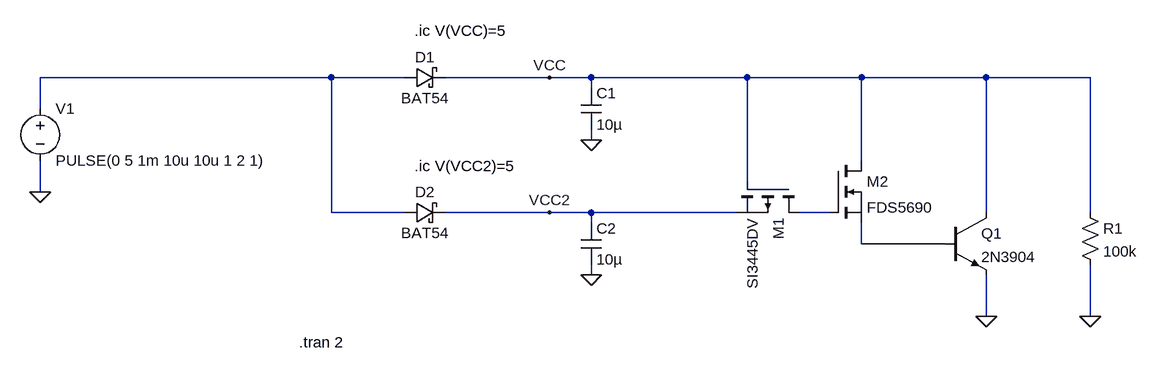
[diagram p0: schematic Draft1.asc]
Draft1.asc, the LTspice schematic file:
Version 4
SHEET 1 1440 680
WIRE 32 80 -416 80
WIRE 144 80 32 80
WIRE 368 80 208 80
WIRE 432 80 368 80
WIRE 672 80 432 80
WIRE 848 80 672 80
WIRE 1040 80 848 80
WIRE 1200 80 1040 80
WIRE 432 96 432 80
WIRE -416 128 -416 80
WIRE 432 176 432 160
WIRE 848 208 848 80
WIRE 672 240 672 80
WIRE -416 256 -416 208
WIRE 32 288 32 80
WIRE 144 288 32 288
WIRE 368 288 208 288
WIRE 432 288 368 288
WIRE 656 288 432 288
WIRE 800 288 752 288
WIRE 1040 288 1040 80
WIRE 1200 288 1200 80
WIRE 432 304 432 288
WIRE 848 336 848 304
WIRE 976 336 848 336
WIRE 432 384 432 368
WIRE 1040 448 1040 384
WIRE 1200 448 1200 368
FLAG -416 256 0
FLAG 432 176 0
FLAG 368 80 VCC
FLAG 1040 448 0
FLAG 432 384 0
FLAG 368 288 VCC2
FLAG 1200 448 0
SYMBOL voltage -416 112 R0
WINDOW 123 0 0 Left 0
WINDOW 39 0 0 Left 0
SYMATTR InstName V1
SYMATTR Value PULSE(0 5 1m 10u 10u 1 2 1)
SYMBOL schottky 144 96 R270
WINDOW 0 32 32 VTop 2
WINDOW 3 0 32 VBottom 2
SYMATTR InstName D1
SYMATTR Value BAT54
SYMATTR Description Diode
SYMATTR Type diode
SYMBOL cap 416 96 R0
SYMATTR InstName C1
SYMATTR Value 10µ
SYMBOL npn 976 288 R0
SYMATTR InstName Q1
SYMATTR Value 2N3904
SYMBOL schottky 144 304 R270
WINDOW 0 32 32 VTop 2
WINDOW 3 0 32 VBottom 2
SYMATTR InstName D2
SYMATTR Value BAT54
SYMATTR Description Diode
SYMATTR Type diode
SYMBOL cap 416 304 R0
SYMATTR InstName C2
SYMATTR Value 10µ
SYMBOL res 1184 272 R0
SYMATTR InstName R1
SYMATTR Value 100k
SYMBOL pmos 752 240 R90
SYMATTR InstName M1
SYMATTR Value SI3445DV
SYMBOL nmos 800 208 R0
SYMATTR InstName M2
SYMATTR Value FDS5690
TEXT -18 488 Left 2 !.tran 2
TEXT 160 8 Left 2 !.ic V(VCC)=5
TEXT 160 216 Left 2 !.ic V(VCC2)=5

The netlist it stands for:
* Draft1.asc
V1 N001 0 PULSE(0 5 1m 10u 10u 1 2 1)
D1 N001 VCC BAT54
C1 VCC 0 10µ
Q1 VCC N003 0 0 2N3904
D2 N001 VCC2 BAT54
C2 VCC2 0 10µ
R1 VCC 0 100k
M1 N002 VCC VCC2 VCC2 SI3445DV
M2 VCC N002 N003 N003 FDS5690
.model D D
.lib standard.dio
.model NPN NPN
.model PNP PNP
.lib standard.bjt
.model NMOS NMOS
.model PMOS PMOS
.lib standard.mos
.tran 2
.ic V(VCC)=5
.ic V(VCC2)=5
.backanno
.end